# Altium schematic sheet S7_CPU.SchDoc
size A3
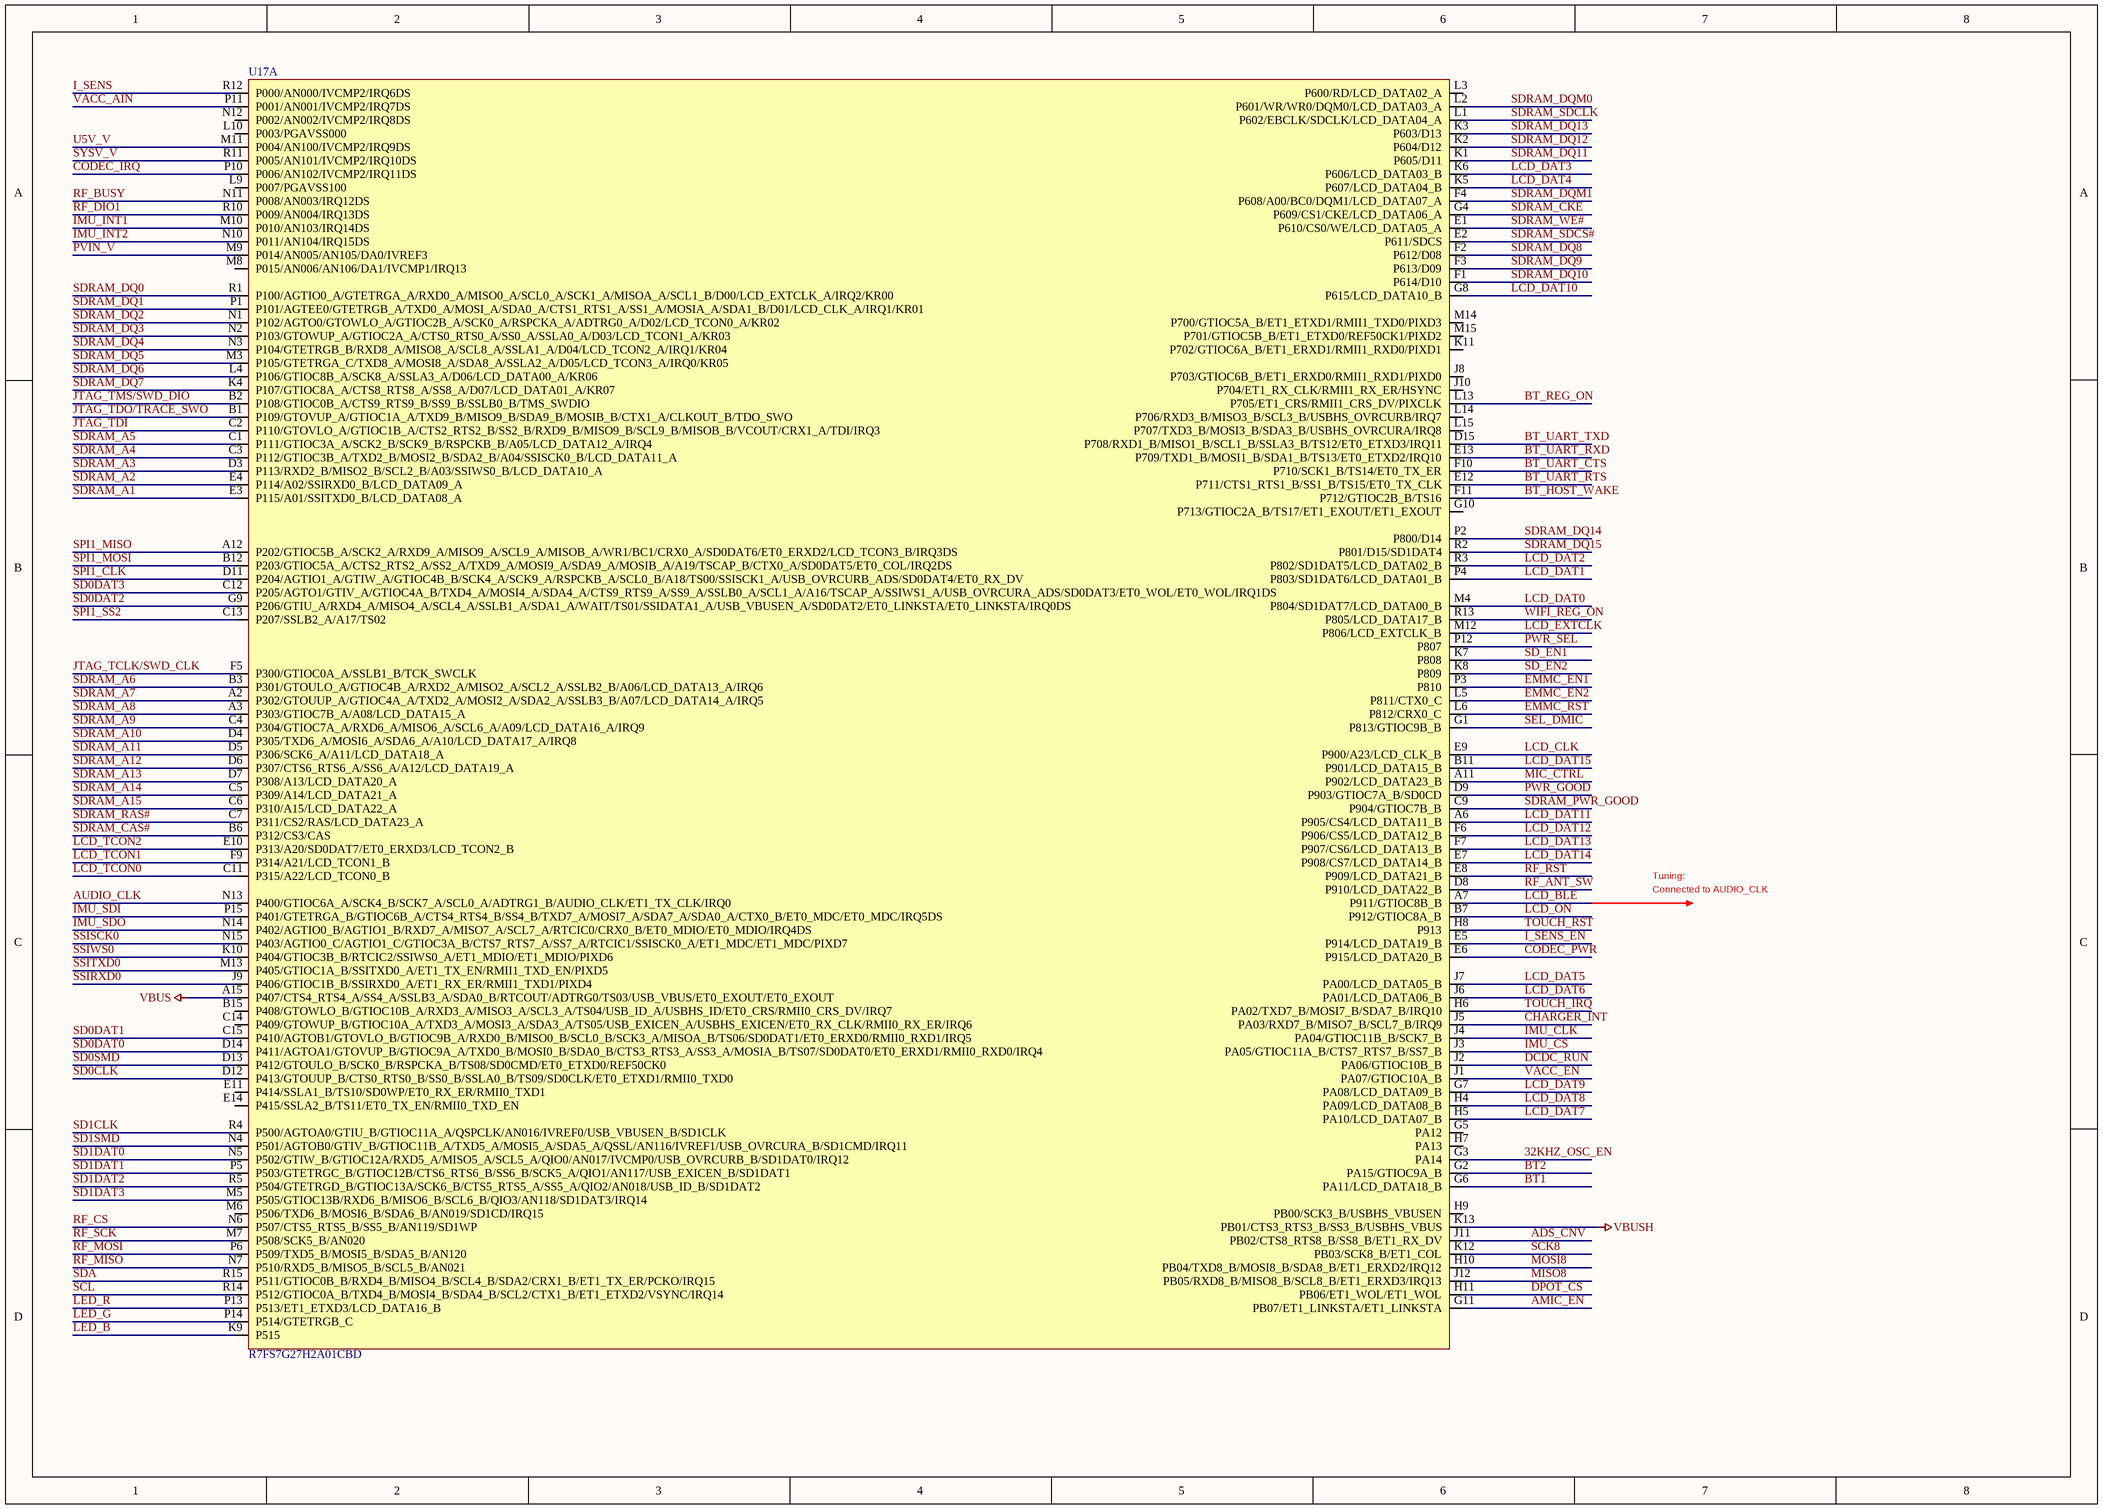
[diagram p0: S7_CPU.SchDoc]

## Parts
U17  R7FS7G27H2A01CBD  [RENESAS_FBGA224]  (part A of 2)

## Nets
VBUS: U17.A15(P407/CTS4_RTS4_A/SS4_A/SSLB3_A/SDA0_B/RTCOUT/ADTRG0/TS03/USB_VBUS/ET0_EXOUT/ET0_EXOUT)
VBUSH: U17.K13(PB01/CTS3_RTS3_B/SS3_B/USBHS_VBUS)
32KHZ_OSC_EN: U17.G3(PA14)
ADS_CNV: U17.J11(PB02/CTS8_RTS8_B/SS8_B/ET1_RX_DV)
AMIC_EN: U17.G11(PB07/ET1_LINKSTA/ET1_LINKSTA)
AUDIO_CLK: U17.N13(P400/GTIOC6A_A/SCK4_B/SCK7_A/SCL0_A/ADTRG1_B/AUDIO_CLK/ET1_TX_CLK/IRQ0)
BT1: U17.G6(PA11/LCD_DATA18_B)
BT2: U17.G2(PA15/GTIOC9A_B)
BT_HOST_WAKE: U17.F11(P712/GTIOC2B_B/TS16)
BT_REG_ON: U17.L13(P705/ET1_CRS/RMII1_CRS_DV/PIXCLK)
BT_UART_CTS: U17.F10(P710/SCK1_B/TS14/ET0_TX_ER)
BT_UART_RTS: U17.E12(P711/CTS1_RTS1_B/SS1_B/TS15/ET0_TX_CLK)
BT_UART_RXD: U17.E13(P709/TXD1_B/MOSI1_B/SDA1_B/TS13/ET0_ETXD2/IRQ10)
BT_UART_TXD: U17.D15(P708/RXD1_B/MISO1_B/SCL1_B/SSLA3_B/TS12/ET0_ETXD3/IRQ11)
CHARGER_INT: U17.J5(PA03/RXD7_B/MISO7_B/SCL7_B/IRQ9)
CODEC_IRQ: U17.P10(P006/AN102/IVCMP2/IRQ11DS)
CODEC_PWR: U17.E6(P915/LCD_DATA20_B)
DCDC_RUN: U17.J2(PA06/GTIOC10B_B)
DPOT_CS: U17.H11(PB06/ET1_WOL/ET1_WOL)
EMMC_EN1: U17.P3(P810)
EMMC_EN2: U17.L5(P811/CTX0_C)
EMMC_RST: U17.L6(P812/CRX0_C)
I_SENS: U17.R12(P000/AN000/IVCMP2/IRQ6DS)
I_SENS_EN: U17.E5(P914/LCD_DATA19_B)
IMU_CLK: U17.J4(PA04/GTIOC11B_B/SCK7_B)
IMU_CS: U17.J3(PA05/GTIOC11A_B/CTS7_RTS7_B/SS7_B)
IMU_INT1: U17.M10(P010/AN103/IRQ14DS)
IMU_INT2: U17.N10(P011/AN104/IRQ15DS)
IMU_SDI: U17.P15(P401/GTETRGA_B/GTIOC6B_A/CTS4_RTS4_B/SS4_B/TXD7_A/MOSI7_A/SDA7_A/SDA0_A/CTX0_B/ET0_MDC/ET0_MDC/IRQ5DS)
IMU_SDO: U17.N14(P402/AGTIO0_B/AGTIO1_B/RXD7_A/MISO7_A/SCL7_A/RTCIC0/CRX0_B/ET0_MDIO/ET0_MDIO/IRQ4DS)
JTAG_TCLK/SWD_CLK: U17.F5(P300/GTIOC0A_A/SSLB1_B/TCK_SWCLK)
JTAG_TDI: U17.C2(P110/GTOVLO_A/GTIOC1B_A/CTS2_RTS2_B/SS2_B/RXD9_B/MISO9_B/SCL9_B/MISOB_B/VCOUT/CRX1_A/TDI/IRQ3)
JTAG_TDO/TRACE_SWO: U17.B1(P109/GTOVUP_A/GTIOC1A_A/TXD9_B/MISO9_B/SDA9_B/MOSIB_B/CTX1_A/CLKOUT_B/TDO_SWO)
JTAG_TMS/SWD_DIO: U17.B2(P108/GTIOC0B_A/CTS9_RTS9_B/SS9_B/SSLB0_B/TMS_SWDIO)
LCD_BLE: U17.A7(P911/GTIOC8B_B)
LCD_CLK: U17.E9(P900/A23/LCD_CLK_B)
LCD_DAT0: U17.M4(P804/SD1DAT7/LCD_DATA00_B)
LCD_DAT1: U17.P4(P803/SD1DAT6/LCD_DATA01_B)
LCD_DAT2: U17.R3(P802/SD1DAT5/LCD_DATA02_B)
LCD_DAT3: U17.K6(P606/LCD_DATA03_B)
LCD_DAT4: U17.K5(P607/LCD_DATA04_B)
LCD_DAT5: U17.J7(PA00/LCD_DATA05_B)
LCD_DAT6: U17.J6(PA01/LCD_DATA06_B)
LCD_DAT7: U17.H5(PA10/LCD_DATA07_B)
LCD_DAT8: U17.H4(PA09/LCD_DATA08_B)
LCD_DAT9: U17.G7(PA08/LCD_DATA09_B)
LCD_DAT10: U17.G8(P615/LCD_DATA10_B)
LCD_DAT11: U17.A6(P905/CS4/LCD_DATA11_B)
LCD_DAT12: U17.F6(P906/CS5/LCD_DATA12_B)
LCD_DAT13: U17.F7(P907/CS6/LCD_DATA13_B)
LCD_DAT14: U17.E7(P908/CS7/LCD_DATA14_B)
LCD_DAT15: U17.B11(P901/LCD_DATA15_B)
LCD_EXTCLK: U17.M12(P806/LCD_EXTCLK_B)
LCD_ON: U17.B7(P912/GTIOC8A_B)
LCD_TCON0: U17.C11(P315/A22/LCD_TCON0_B)
LCD_TCON1: U17.F9(P314/A21/LCD_TCON1_B)
LCD_TCON2: U17.E10(P313/A20/SD0DAT7/ET0_ERXD3/LCD_TCON2_B)
LED_B: U17.K9(P515)
LED_G: U17.P14(P514/GTETRGB_C)
LED_R: U17.P13(P513/ET1_ETXD3/LCD_DATA16_B)
MIC_CTRL: U17.A11(P902/LCD_DATA23_B)
MISO8: U17.J12(PB05/RXD8_B/MISO8_B/SCL8_B/ET1_ERXD3/IRQ13)
MOSI8: U17.H10(PB04/TXD8_B/MOSI8_B/SDA8_B/ET1_ERXD2/IRQ12)
PVIN_V: U17.M9(P014/AN005/AN105/DA0/IVREF3)
PWR_GOOD: U17.D9(P903/GTIOC7A_B/SD0CD)
PWR_SEL: U17.P12(P807)
RF_ANT_SW: U17.D8(P910/LCD_DATA22_B)
RF_BUSY: U17.N11(P008/AN003/IRQ12DS)
RF_CS: U17.N6(P507/CTS5_RTS5_B/SS5_B/AN119/SD1WP)
RF_DIO1: U17.R10(P009/AN004/IRQ13DS)
RF_MISO: U17.N7(P510/RXD5_B/MISO5_B/SCL5_B/AN021)
RF_MOSI: U17.P6(P509/TXD5_B/MOSI5_B/SDA5_B/AN120)
RF_RST: U17.E8(P909/LCD_DATA21_B)
RF_SCK: U17.M7(P508/SCK5_B/AN020)
SCK8: U17.K12(PB03/SCK8_B/ET1_COL)
SCL: U17.R14(P512/GTIOC0A_B/TXD4_B/MOSI4_B/SDA4_B/SCL2/CTX1_B/ET1_ETXD2/VSYNC/IRQ14)
SD0CLK: U17.D12(P413/GTOUUP_B/CTS0_RTS0_B/SS0_B/SSLA0_B/TS09/SD0CLK/ET0_ETXD1/RMII0_TXD0)
SD0DAT0: U17.D14(P411/AGTOA1/GTOVUP_B/GTIOC9A_A/TXD0_B/MOSI0_B/SDA0_B/CTS3_RTS3_A/SS3_A/MOSIA_B/TS07/SD0DAT0/ET0_ERXD1/RMII0_RXD0/IRQ4)
SD0DAT1: U17.C15(P410/AGTOB1/GTOVLO_B/GTIOC9B_A/RXD0_B/MISO0_B/SCL0_B/SCK3_A/MISOA_B/TS06/SD0DAT1/ET0_ERXD0/RMII0_RXD1/IRQ5)
SD0DAT2: U17.G9(P206/GTIU_A/RXD4_A/MISO4_A/SCL4_A/SSLB1_A/SDA1_A/WAIT/TS01/SSIDATA1_A/USB_VBUSEN_A/SD0DAT2/ET0_LINKSTA/ET0_LINKSTA/IRQ0DS)
SD0DAT3: U17.C12(P205/AGTO1/GTIV_A/GTIOC4A_B/TXD4_A/MOSI4_A/SDA4_A/CTS9_RTS9_A/SS9_A/SSLB0_A/SCL1_A/A16/TSCAP_A/SSIWS1_A/USB_OVRCURA_ADS/SD0DAT3/ET0_WOL/ET0_WOL/IRQ1DS)
SD0SMD: U17.D13(P412/GTOULO_B/SCK0_B/RSPCKA_B/TS08/SD0CMD/ET0_ETXD0/REF50CK0)
SD1CLK: U17.R4(P500/AGTOA0/GTIU_B/GTIOC11A_A/QSPCLK/AN016/IVREF0/USB_VBUSEN_B/SD1CLK)
SD1DAT0: U17.N5(P502/GTIW_B/GTIOC12A/RXD5_A/MISO5_A/SCL5_A/QIO0/AN017/IVCMP0/USB_OVRCURB_B/SD1DAT0/IRQ12)
SD1DAT1: U17.P5(P503/GTETRGC_B/GTIOC12B/CTS6_RTS6_B/SS6_B/SCK5_A/QIO1/AN117/USB_EXICEN_B/SD1DAT1)
SD1DAT2: U17.R5(P504/GTETRGD_B/GTIOC13A/SCK6_B/CTS5_RTS5_A/SS5_A/QIO2/AN018/USB_ID_B/SD1DAT2)
SD1DAT3: U17.M5(P505/GTIOC13B/RXD6_B/MISO6_B/SCL6_B/QIO3/AN118/SD1DAT3/IRQ14)
SD1SMD: U17.N4(P501/AGTOB0/GTIV_B/GTIOC11B_A/TXD5_A/MOSI5_A/SDA5_A/QSSL/AN116/IVREF1/USB_OVRCURA_B/SD1CMD/IRQ11)
SD_EN1: U17.K7(P808)
SD_EN2: U17.K8(P809)
SDA: U17.R15(P511/GTIOC0B_B/RXD4_B/MISO4_B/SCL4_B/SDA2/CRX1_B/ET1_TX_ER/PCKO/IRQ15)
SDRAM_A1: U17.E3(P115/A01/SSITXD0_B/LCD_DATA08_A)
SDRAM_A2: U17.E4(P114/A02/SSIRXD0_B/LCD_DATA09_A)
SDRAM_A3: U17.D3(P113/RXD2_B/MISO2_B/SCL2_B/A03/SSIWS0_B/LCD_DATA10_A)
SDRAM_A4: U17.C3(P112/GTIOC3B_A/TXD2_B/MOSI2_B/SDA2_B/A04/SSISCK0_B/LCD_DATA11_A)
SDRAM_A5: U17.C1(P111/GTIOC3A_A/SCK2_B/SCK9_B/RSPCKB_B/A05/LCD_DATA12_A/IRQ4)
SDRAM_A6: U17.B3(P301/GTOULO_A/GTIOC4B_A/RXD2_A/MISO2_A/SCL2_A/SSLB2_B/A06/LCD_DATA13_A/IRQ6)
SDRAM_A7: U17.A2(P302/GTOUUP_A/GTIOC4A_A/TXD2_A/MOSI2_A/SDA2_A/SSLB3_B/A07/LCD_DATA14_A/IRQ5)
SDRAM_A8: U17.A3(P303/GTIOC7B_A/A08/LCD_DATA15_A)
SDRAM_A9: U17.C4(P304/GTIOC7A_A/RXD6_A/MISO6_A/SCL6_A/A09/LCD_DATA16_A/IRQ9)
SDRAM_A10: U17.D4(P305/TXD6_A/MOSI6_A/SDA6_A/A10/LCD_DATA17_A/IRQ8)
SDRAM_A11: U17.D5(P306/SCK6_A/A11/LCD_DATA18_A)
SDRAM_A12: U17.D6(P307/CTS6_RTS6_A/SS6_A/A12/LCD_DATA19_A)
SDRAM_A13: U17.D7(P308/A13/LCD_DATA20_A)
SDRAM_A14: U17.C5(P309/A14/LCD_DATA21_A)
SDRAM_A15: U17.C6(P310/A15/LCD_DATA22_A)
SDRAM_CAS#: U17.B6(P312/CS3/CAS)
SDRAM_CKE: U17.G4(P609/CS1/CKE/LCD_DATA06_A)
SDRAM_DQ0: U17.R1(P100/AGTIO0_A/GTETRGA_A/RXD0_A/MISO0_A/SCL0_A/SCK1_A/MISOA_A/SCL1_B/D00/LCD_EXTCLK_A/IRQ2/KR00)
SDRAM_DQ1: U17.P1(P101/AGTEE0/GTETRGB_A/TXD0_A/MOSI_A/SDA0_A/CTS1_RTS1_A/SS1_A/MOSIA_A/SDA1_B/D01/LCD_CLK_A/IRQ1/KR01)
SDRAM_DQ2: U17.N1(P102/AGTO0/GTOWLO_A/GTIOC2B_A/SCK0_A/RSPCKA_A/ADTRG0_A/D02/LCD_TCON0_A/KR02)
SDRAM_DQ3: U17.N2(P103/GTOWUP_A/GTIOC2A_A/CTS0_RTS0_A/SS0_A/SSLA0_A/D03/LCD_TCON1_A/KR03)
SDRAM_DQ4: U17.N3(P104/GTETRGB_B/RXD8_A/MISO8_A/SCL8_A/SSLA1_A/D04/LCD_TCON2_A/IRQ1/KR04)
SDRAM_DQ5: U17.M3(P105/GTETRGA_C/TXD8_A/MOSI8_A/SDA8_A/SSLA2_A/D05/LCD_TCON3_A/IRQ0/KR05)
SDRAM_DQ6: U17.L4(P106/GTIOC8B_A/SCK8_A/SSLA3_A/D06/LCD_DATA00_A/KR06)
SDRAM_DQ7: U17.K4(P107/GTIOC8A_A/CTS8_RTS8_A/SS8_A/D07/LCD_DATA01_A/KR07)
SDRAM_DQ8: U17.F2(P612/D08)
SDRAM_DQ9: U17.F3(P613/D09)
SDRAM_DQ10: U17.F1(P614/D10)
SDRAM_DQ11: U17.K1(P605/D11)
SDRAM_DQ12: U17.K2(P604/D12)
SDRAM_DQ13: U17.K3(P603/D13)
SDRAM_DQ14: U17.P2(P800/D14)
SDRAM_DQ15: U17.R2(P801/D15/SD1DAT4)
SDRAM_DQM0: U17.L2(P601/WR/WR0/DQM0/LCD_DATA03_A)
SDRAM_DQM1: U17.F4(P608/A00/BC0/DQM1/LCD_DATA07_A)
SDRAM_PWR_GOOD: U17.C9(P904/GTIOC7B_B)
SDRAM_RAS#: U17.C7(P311/CS2/RAS/LCD_DATA23_A)
SDRAM_SDCLK: U17.L1(P602/EBCLK/SDCLK/LCD_DATA04_A)
SDRAM_SDCS#: U17.E2(P611/SDCS)
SDRAM_WE#: U17.E1(P610/CS0/WE/LCD_DATA05_A)
SEL_DMIC: U17.G1(P813/GTIOC9B_B)
SPI1_CLK: U17.D11(P204/AGTIO1_A/GTIW_A/GTIOC4B_B/SCK4_A/SCK9_A/RSPCKB_A/SCL0_B/A18/TS00/SSISCK1_A/USB_OVRCURB_ADS/SD0DAT4/ET0_RX_DV)
SPI1_MISO: U17.A12(P202/GTIOC5B_A/SCK2_A/RXD9_A/MISO9_A/SCL9_A/MISOB_A/WR1/BC1/CRX0_A/SD0DAT6/ET0_ERXD2/LCD_TCON3_B/IRQ3DS)
SPI1_MOSI: U17.B12(P203/GTIOC5A_A/CTS2_RTS2_A/SS2_A/TXD9_A/MOSI9_A/SDA9_A/MOSIB_A/A19/TSCAP_B/CTX0_A/SD0DAT5/ET0_COL/IRQ2DS)
SPI1_SS2: U17.C13(P207/SSLB2_A/A17/TS02)
SSIRXD0: U17.J9(P406/GTIOC1B_B/SSIRXD0_A/ET1_RX_ER/RMII1_TXD1/PIXD4)
SSISCK0: U17.N15(P403/AGTIO0_C/AGTIO1_C/GTIOC3A_B/CTS7_RTS7_A/SS7_A/RTCIC1/SSISCK0_A/ET1_MDC/ET1_MDC/PIXD7)
SSITXD0: U17.M13(P405/GTIOC1A_B/SSITXD0_A/ET1_TX_EN/RMII1_TXD_EN/PIXD5)
SSIWS0: U17.K10(P404/GTIOC3B_B/RTCIC2/SSIWS0_A/ET1_MDIO/ET1_MDIO/PIXD6)
SYSV_V: U17.R11(P005/AN101/IVCMP2/IRQ10DS)
TOUCH_IRQ: U17.H6(PA02/TXD7_B/MOSI7_B/SDA7_B/IRQ10)
TOUCH_RST: U17.H8(P913)
U5V_V: U17.M11(P004/AN100/IVCMP2/IRQ9DS)
VACC_AIN: U17.P11(P001/AN001/IVCMP2/IRQ7DS)
VACC_EN: U17.J1(PA07/GTIOC10A_B)
WIFI_REG_ON: U17.R13(P805/LCD_DATA17_B)

Not connected (* = marked no-connect by the designer): U17 B15(P408/GTOWLO_B/GTIOC10B_A/RXD3_A/MISO3_A/SCL3_A/TS04/USB_ID_A/USBHS_ID/ET0_CRS/RMII0_CRS_DV/IRQ7) C14(P409/GTOWUP_B/GTIOC10A_A/TXD3_A/MOSI3_A/SDA3_A/TS05/USB_EXICEN_A/USBHS_EXICEN/ET0_RX_CLK/RMII0_RX_ER/IRQ6) E11(P414/SSLA1_B/TS10/SD0WP/ET0_RX_ER/RMII0_TXD1) E14(P415/SSLA2_B/TS11/ET0_TX_EN/RMII0_TXD_EN) G5(PA12) G10(P713/GTIOC2A_B/TS17/ET1_EXOUT/ET1_EXOUT) H7(PA13) H9(PB00/SCK3_B/USBHS_VBUSEN) J8(P703/GTIOC6B_B/ET1_ERXD0/RMII1_RXD1/PIXD0) J10(P704/ET1_RX_CLK/RMII1_RX_ER/HSYNC) K11(P702/GTIOC6A_B/ET1_ERXD1/RMII1_RXD0/PIXD1) L3(P600/RD/LCD_DATA02_A) L9(P007/PGAVSS100) L10(P003/PGAVSS000) L14(P706/RXD3_B/MISO3_B/SCL3_B/USBHS_OVRCURB/IRQ7) L15(P707/TXD3_B/MOSI3_B/SDA3_B/USBHS_OVRCURA/IRQ8) M6(P506/TXD6_B/MOSI6_B/SDA6_B/AN019/SD1CD/IRQ15) M8(P015/AN006/AN106/DA1/IVCMP1/IRQ13) M14(P700/GTIOC5A_B/ET1_ETXD1/RMII1_TXD0/PIXD3) M15(P701/GTIOC5B_B/ET1_ETXD0/REF50CK1/PIXD2) N12(P002/AN002/IVCMP2/IRQ8DS)

## Notes on the sheet
- Tuning:
- Connected to AUDIO_CLK

## Library data of the parts
U17 = R7FS7G27H2A01CBD#AC0: Manufacturer: Renesas; PartNum: R7FS7G27H2A01CBD#AC0-ND; Distributor: Digi-Key; PartName: R7FS7G27H2A01CBD#AC0; Price: 24$